# Altium schematic sheet Oled Display and Bluetooth Sensor.SchDoc
size A; SheetNumber: 7; SheetTotal: 8
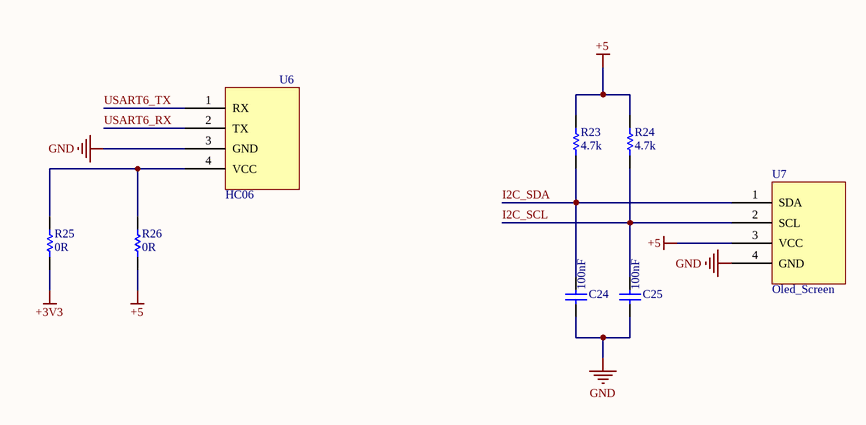
[diagram p0: Oled Display and Bluetooth Sensor.SchDoc]

## Parts
C24  value 100nF  [CAPC2013X135X45LL10T25]  (hidden comment: GRM21BR71H105KA12L)
C25  value 100nF  [CAPC2013X135X45LL10T25]  (hidden comment: GRM21BR71H105KA12L)
R23  value 4.7k  [RESC2013X70X40NL20T20]  (hidden comment: ERJ6ENF47R0V)
R24  value 4.7k  [RESC2013X70X40NL20T20]  (hidden comment: ERJ6ENF47R0V)
R25  value 0R  [RESC2013X70X40NL20T20]  (hidden comment: ERJ6ENF47R0V)
R26  value 0R  [RESC2013X70X40NL20T20]  (hidden comment: ERJ6ENF47R0V)
U6  HC06  [HC06]
U7  Oled_Screen  [Oled_Ekran]

## Nets
+3V3: R25.2
+5: R23.1 R24.1 R26.2 U7.3(VCC)
GND: C24.1 C25.1 U6.3(GND) U7.4(GND)
I2C_SCL: C25.2 R24.2 U7.2(SCL)
I2C_SDA: C24.2 R23.2 U7.1(SDA)
USART6_RX: U6.2(TX)
USART6_TX: U6.1(RX)
NetR25_1: R25.1 R26.1 U6.4(VCC)

## Library data of the parts
C24 C25 = CMP-1036-04761-2: Manufacturer: Murata; Part Number: GRM21BR71H105KA12L
R23-R26 = CMP-2001-00205-1: Manufacturer: Panasonic; Part Number: ERJ6ENF47R0V
U6 = HC06: HC06 Bluetooth Sensor
U7 = Oled Ekran: I2C Communication 0.96inch 5V Oled Screen